# Altium project mwh618.prjpcb (part 2 of 2)

## Sheet soc-io.schdoc: IO
size A4; Date: 09.27.2026; CheckedBy: BCY; DrawnBy: miaow; Revision: v1.0.0; SheetNumber: 7; SheetTotal: 18; BoardType: MAIN_PCB; Desc: Connectivity
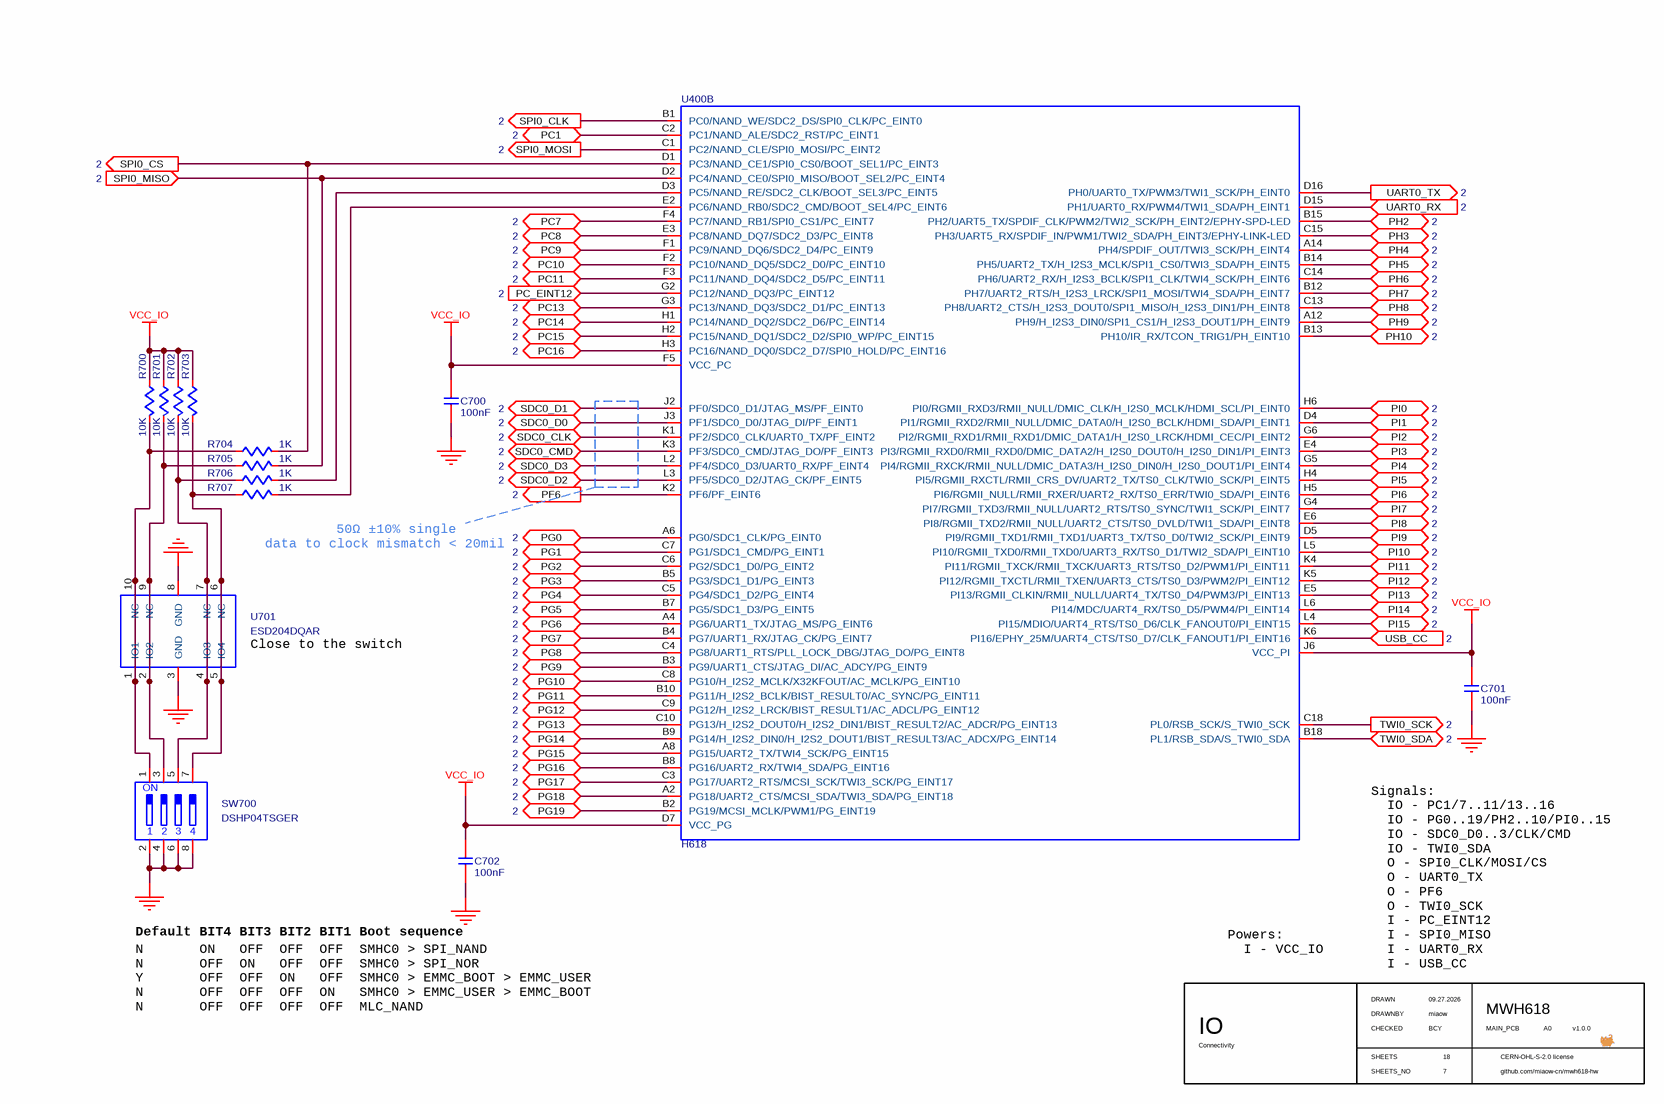
[diagram p8: soc-io.schdoc]

### Parts
C700  value 100nF  [C0201]  (hidden comment: C-NOMO)
C701  value 100nF  [C0201]  (hidden comment: C-NOMO)
C702  value 100nF  [C0201]  (hidden comment: C-NOMO)
R700  value 10K  [R0402]  (hidden comment: R)
R701  value 10K  [R0402]  (hidden comment: R)
R702  value 10K  [R0402]  (hidden comment: R)
R703  value 10K  [R0402]  (hidden comment: R)
R704  value 1K  [R0402]  (hidden comment: R)
R705  value 1K  [R0402]  (hidden comment: R)
R706  value 1K  [R0402]  (hidden comment: R)
R707  value 1K  [R0402]  (hidden comment: R)
SW700  DSHP04TSGER  [DSHP04TSGER]
U400  H618  [H618]  (part B of 4)
U701  ESD204DQAR  [ESD204DQAR]

### Ports
PC1 (bidir, see 2), PC7 (bidir, see 2), PC8 (bidir, see 2), PC9 (bidir, see 2), PC10 (bidir, see 2), PC11 (bidir, see 2), PC13 (bidir, see 2), PC14 (bidir, see 2), PC15 (bidir, see 2), PC16 (bidir, see 2), PC_EINT12 (in, see 2), PF6 (out, see 2), PG0 (bidir, see 2), PG1 (bidir, see 2), PG2 (bidir, see 2), PG3 (bidir, see 2), PG4 (bidir, see 2), PG5 (bidir, see 2), PG6 (bidir, see 2), PG7 (bidir, see 2), PG8 (bidir, see 2), PG9 (bidir, see 2), PG10 (bidir, see 2), PG11 (bidir, see 2), PG12 (bidir, see 2), PG13 (bidir, see 2), PG14 (bidir, see 2), PG15 (bidir, see 2), PG16 (bidir, see 2), PG17 (bidir, see 2), PG18 (bidir, see 2), PG19 (bidir, see 2), PH2 (bidir, see 2), PH3 (bidir, see 2), PH4 (bidir, see 2), PH5 (bidir, see 2), PH6 (bidir, see 2), PH7 (bidir, see 2), PH8 (bidir, see 2), PH9 (bidir, see 2), PH10 (bidir, see 2), PI0 (bidir, see 2), PI1 (bidir, see 2), PI2 (bidir, see 2), PI3 (bidir, see 2), PI4 (bidir, see 2), PI5 (bidir, see 2), PI6 (bidir, see 2), PI7 (bidir, see 2), PI8 (bidir, see 2), PI9 (bidir, see 2), PI10 (bidir, see 2), PI11 (bidir, see 2), PI12 (bidir, see 2), PI13 (bidir, see 2), PI14 (bidir, see 2), PI15 (bidir, see 2), SDC0_CLK (bidir, see 2), SDC0_CMD (bidir, see 2), SDC0_D0 (bidir, see 2), SDC0_D1 (bidir, see 2), SDC0_D2 (bidir, see 2), SDC0_D3 (bidir, see 2), SPI0_CLK (out, see 2), SPI0_CS (out, see 2), SPI0_MISO (in, see 2), SPI0_MOSI (out, see 2), TWI0_SCK (out, see 2), TWI0_SDA (bidir, see 2), UART0_RX (in, see 2), UART0_TX (out, see 2), USB_CC (in, see 2)

### Nets
GND: C700.2 C701.2 C702.2 SW700.2 SW700.4 SW700.6 SW700.8 U701.3(GND) U701.8(GND)
VCC_IO: C700.1 C701.1 C702.1 R700.2 R701.2 R702.2 R703.2 U400.D7(VCC_PG) U400.F5(VCC_PC) U400.J6(VCC_PI)  [project net VCC3V3_DLDO]
_H_3: U400.B8(PG16/UART2_RX/TWI4_SDA/PG_EINT16) ; port PG16
_H_5: U400.A8(PG15/UART2_TX/TWI4_SCK/PG_EINT15) ; port PG15
_H_7: U400.A2(PG18/UART2_CTS/MCSI_SDA/TWI3_SDA/PG_EINT18) ; port PG18
_H_11: U400.C3(PG17/UART2_RTS/MCSI_SCK/TWI3_SCK/PG_EINT17) ; port PG17
_H_12: U400.B2(PG19/MCSI_MCLK/PWM1/PG_EINT19) ; port PG19
_H_13: U400.E3(PC8/NAND_DQ7/SDC2_D3/PC_EINT8) ; port PC8
_H_15: U400.B13(PH10/IR_RX/TCON_TRIG1/PH_EINT10) ; port PH10
_H_16: U400.H3(PC16/NAND_DQ0/SDC2_D7/SPI0_HOLD/PC_EINT16) ; port PC16
_H_18: U400.G3(PC13/NAND_DQ3/SDC2_D1/PC_EINT13) ; port PC13
_H_19: U400.B12(PH7/UART2_RTS/H_I2S3_LRCK/SPI1_MOSI/TWI4_SDA/PH_EINT7) ; port PH7
_H_21: U400.C13(PH8/UART2_CTS/H_I2S3_DOUT0/SPI1_MISO/H_I2S3_DIN1/PH_EINT8) ; port PH8
_H_22: U400.H2(PC15/NAND_DQ1/SDC2_D2/SPI0_WP/PC_EINT15) ; port PC15
_H_23: U400.C14(PH6/UART2_RX/H_I2S3_BCLK/SPI1_CLK/TWI4_SCK/PH_EINT6) ; port PH6
_H_24: U400.H1(PC14/NAND_DQ2/SDC2_D6/PC_EINT14) ; port PC14
_H_26: U400.F2(PC10/NAND_DQ5/SDC2_D0/PC_EINT10) ; port PC10
_H_27: U400.F3(PC11/NAND_DQ4/SDC2_D5/PC_EINT11) ; port PC11
_H_28: U400.F1(PC9/NAND_DQ6/SDC2_D4/PC_EINT9) ; port PC9
_H_29: U400.F4(PC7/NAND_RB1/SPI0_CS1/PC_EINT7) ; port PC7
_H_31: U400.C9(PG12/H_I2S2_LRCK/BIST_RESULT1/AC_ADCL/PG_EINT12) ; port PG12
_H_32: U400.C2(PC1/NAND_ALE/SDC2_RST/PC_EINT1) ; port PC1
_H_33: U400.B10(PG11/H_I2S2_BCLK/BIST_RESULT0/AC_SYNC/PG_EINT11) ; port PG11
_H_35: U400.A12(PH9/H_I2S3_DIN0/SPI1_CS1/H_I2S3_DOUT1/PH_EINT9) ; port PH9
_H_36: U400.B9(PG14/H_I2S2_DIN0/H_I2S2_DOUT1/BIST_RESULT3/AC_ADCX/PG_EINT14) ; port PG14
_H_37: U400.B14(PH5/UART2_TX/H_I2S3_MCLK/SPI1_CS0/TWI3_SDA/PH_EINT5) ; port PH5
_H_38: U400.C10(PG13/H_I2S2_DOUT0/H_I2S2_DIN1/BIST_RESULT2/AC_ADCR/PG_EINT13) ; port PG13
_H_40: U400.A14(PH4/SPDIF_OUT/TWI3_SCK/PH_EINT4) ; port PH4
DEBUG_RX: U400.D16(PH0/UART0_TX/PWM3/TWI1_SCK/PH_EINT0) ; port UART0_TX
DEBUG_TX: U400.D15(PH1/UART0_RX/PWM4/TWI1_SDA/PH_EINT1) ; port UART0_RX
FLASH_CLK: U400.B1(PC0/NAND_WE/SDC2_DS/SPI0_CLK/PC_EINT0) ; port SPI0_CLK
FLASH_CS: R704.1 U400.D1(PC3/NAND_CE1/SPI0_CS0/BOOT_SEL1/PC_EINT3) ; port SPI0_CS
FLASH_MISO: R705.1 U400.D2(PC4/NAND_CE0/SPI0_MISO/BOOT_SEL2/PC_EINT4) ; port SPI0_MISO
FLASH_MOSI: U400.C1(PC2/NAND_CLE/SPI0_MOSI/PC_EINT2) ; port SPI0_MOSI
FPC_1: U400.L4(PI15/MDIO/UART4_RTS/TS0_D6/CLK_FANOUT0/PI_EINT15) ; port PI15
FPC_2: U400.L6(PI14/MDC/UART4_RX/TS0_D5/PWM4/PI_EINT14) ; port PI14
FPC_3: U400.E5(PI13/RGMII_CLKIN/RMII_NULL/UART4_TX/TS0_D4/PWM3/PI_EINT13) ; port PI13
FPC_4: U400.K5(PI12/RGMII_TXCTL/RMII_TXEN/UART3_CTS/TS0_D3/PWM2/PI_EINT12) ; port PI12
FPC_5: U400.K4(PI11/RGMII_TXCK/RMII_TXCK/UART3_RTS/TS0_D2/PWM1/PI_EINT11) ; port PI11
FPC_6: U400.L5(PI10/RGMII_TXD0/RMII_TXD0/UART3_RX/TS0_D1/TWI2_SDA/PI_EINT10) ; port PI10
FPC_7: U400.D5(PI9/RGMII_TXD1/RMII_TXD1/UART3_TX/TS0_D0/TWI2_SCK/PI_EINT9) ; port PI9
FPC_8: U400.E6(PI8/RGMII_TXD2/RMII_NULL/UART2_CTS/TS0_DVLD/TWI1_SDA/PI_EINT8) ; port PI8
FPC_9: U400.G4(PI7/RGMII_TXD3/RMII_NULL/UART2_RTS/TS0_SYNC/TWI1_SCK/PI_EINT7) ; port PI7
FPC_10: U400.H5(PI6/RGMII_NULL/RMII_RXER/UART2_RX/TS0_ERR/TWI0_SDA/PI_EINT6) ; port PI6
FPC_11: U400.H4(PI5/RGMII_RXCTL/RMII_CRS_DV/UART2_TX/TS0_CLK/TWI0_SCK/PI_EINT5) ; port PI5
FPC_12: U400.G5(PI4/RGMII_RXCK/RMII_NULL/DMIC_DATA3/H_I2S0_DIN0/H_I2S0_DOUT1/PI_EINT4) ; port PI4
FPC_13: U400.E4(PI3/RGMII_RXD0/RMII_RXD0/DMIC_DATA2/H_I2S0_DOUT0/H_I2S0_DIN1/PI_EINT3) ; port PI3
FPC_14: U400.G6(PI2/RGMII_RXD1/RMII_RXD1/DMIC_DATA1/H_I2S0_LRCK/HDMI_CEC/PI_EINT2) ; port PI2
FPC_15: U400.D4(PI1/RGMII_RXD2/RMII_NULL/DMIC_DATA0/H_I2S0_BCLK/HDMI_SDA/PI_EINT1) ; port PI1
FPC_16: U400.H6(PI0/RGMII_RXD3/RMII_NULL/DMIC_CLK/H_I2S0_MCLK/HDMI_SCL/PI_EINT0) ; port PI0
FPC_18: U400.C8(PG10/H_I2S2_MCLK/X32KFOUT/AC_MCLK/PG_EINT10) ; port PG10
FPC_19: U400.B3(PG9/UART1_CTS/JTAG_DI/AC_ADCY/PG_EINT9) ; port PG9
FPC_20: U400.C4(PG8/UART1_RTS/PLL_LOCK_DBG/JTAG_DO/PG_EINT8) ; port PG8
FPC_21: U400.B4(PG7/UART1_RX/JTAG_CK/PG_EINT7) ; port PG7
FPC_22: U400.A4(PG6/UART1_TX/JTAG_MS/PG_EINT6) ; port PG6
FPC_23: U400.B7(PG5/SDC1_D3/PG_EINT5) ; port PG5
FPC_24: U400.C5(PG4/SDC1_D2/PG_EINT4) ; port PG4
FPC_25: U400.B5(PG3/SDC1_D1/PG_EINT3) ; port PG3
FPC_26: U400.C6(PG2/SDC1_D0/PG_EINT2) ; port PG2
FPC_27: U400.C7(PG1/SDC1_CMD/PG_EINT1) ; port PG1
FPC_28: U400.A6(PG0/SDC1_CLK/PG_EINT0) ; port PG0
INDICATOR_LED: U400.K2(PF6/PF_EINT6) ; port PF6
PC_EINT12: U400.G2(PC12/NAND_DQ3/PC_EINT12) ; port PC_EINT12
PH2: U400.B15(PH2/UART5_TX/SPDIF_CLK/PWM2/TWI2_SCK/PH_EINT2/EPHY-SPD-LED) ; port PH2
PH3: U400.C15(PH3/UART5_RX/SPDIF_IN/PWM1/TWI2_SDA/PH_EINT3/EPHY-LINK-LED) ; port PH3
PMIC_SCL: U400.C18(PL0/RSB_SCK/S_TWI0_SCK) ; port TWI0_SCK
PMIC_SDA: U400.B18(PL1/RSB_SDA/S_TWI0_SDA) ; port TWI0_SDA
SD_CLK: U400.K1(PF2/SDC0_CLK/UART0_TX/PF_EINT2) ; port SDC0_CLK
SD_CMD: U400.K3(PF3/SDC0_CMD/JTAG_DO/PF_EINT3) ; port SDC0_CMD
SD_D0: U400.J3(PF1/SDC0_D0/JTAG_DI/PF_EINT1) ; port SDC0_D0
SD_D1: U400.J2(PF0/SDC0_D1/JTAG_MS/PF_EINT0) ; port SDC0_D1
SD_D2: U400.L3(PF5/SDC0_D2/JTAG_CK/PF_EINT5) ; port SDC0_D2
SD_D3: U400.L2(PF4/SDC0_D3/UART0_RX/PF_EINT4) ; port SDC0_D3
USB_0_CC: U400.K6(PI16/EPHY_25M/UART4_CTS/TS0_D7/CLK_FANOUT1/PI_EINT16) ; port USB_CC
NetR700_1: R700.1 R704.2 SW700.1 U701.1(IO1) U701.10(NC)
NetR701_1: R701.1 R705.2 SW700.3 U701.2(IO2) U701.9(NC)
NetR702_1: R702.1 R706.2 SW700.5 U701.4(IO3) U701.7(NC)
NetR703_1: R703.1 R707.2 SW700.7 U701.5(IO4) U701.6(NC)
NetR706_1: R706.1 U400.D3(PC5/NAND_RE/SDC2_CLK/BOOT_SEL3/PC_EINT5)
NetR707_1: R707.1 U400.E2(PC6/NAND_RB0/SDC2_CMD/BOOT_SEL4/PC_EINT6)

### Notes on the sheet
- data to clock mismatch < 20mil
- 50Ω ±10% single
- (near U701) Close to the switch
- Default BIT4 BIT3 BIT2 BIT1 Boot sequence
- Powers:
  I - VCC_IO
- Signals:
  IO - PC1/7..11/13..16
  IO - PG0..19/PH2..10/PI0..15
  IO - SDC0_D0..3/CLK/CMD
  IO - TWI0_SDA
  O - SPI0_CLK/MOSI/CS
  O - UART0_TX
  O - PF6
  O - TWI0_SCK
  I - PC_EINT12
  I - SPI0_MISO
  I - UART0_RX
  I - USB_CC
- N       ON   OFF  OFF  OFF  SMHC0 > SPI_NAND
  N       OFF  ON   OFF  OFF  SMHC0 > SPI_NOR
  Y       OFF  OFF  ON   OFF  SMHC0 > EMMC_BOOT > EMMC_USER
  N       OFF  OFF  OFF  ON   SMHC0 > EMMC_USER > EMMC_BOOT
  N       OFF  OFF  OFF  OFF  MLC_NAND
- DRAWN
- CHECKED
- DRAWNBY
- SHEETS
- SHEETS_NO
- (in symbol DSHP04TSGER) ON

### Library data of the parts
C700-C702 = C-NOMO: voltage: 10V; precision: 10%; Supplier 1: LCSC; Supplier Part Number 1: C49062
R700-R707 = R: precision: 1%; Supplier 1: LCSC
  R700-R703: Supplier Part Number 1: C25744
  R704-R707: Supplier Part Number 1: C11702
U400 = H618: SOC; Supplier 1: LCSC; Supplier Part Number 1: C19189292
U701 = ESD204DQAR: TVS/ESD - 4 ch, 3.6V, 5V, 0.55pF@1MHz, 30KV; Supplier 1: LCSC; Supplier Part Number 1: C553132
SW700 = DSHP04TSGER: Supplier 1: LCSC; Supplier Part Number 1: C3293144

## Sheet debug.schdoc: DEBUG
size A4; Date: 10.01.2026; CheckedBy: BCY; DrawnBy: miaow; Revision: v1.0.0; SheetNumber: 14; SheetTotal: 18; BoardType: MAIN_PCB; Desc: UART & console
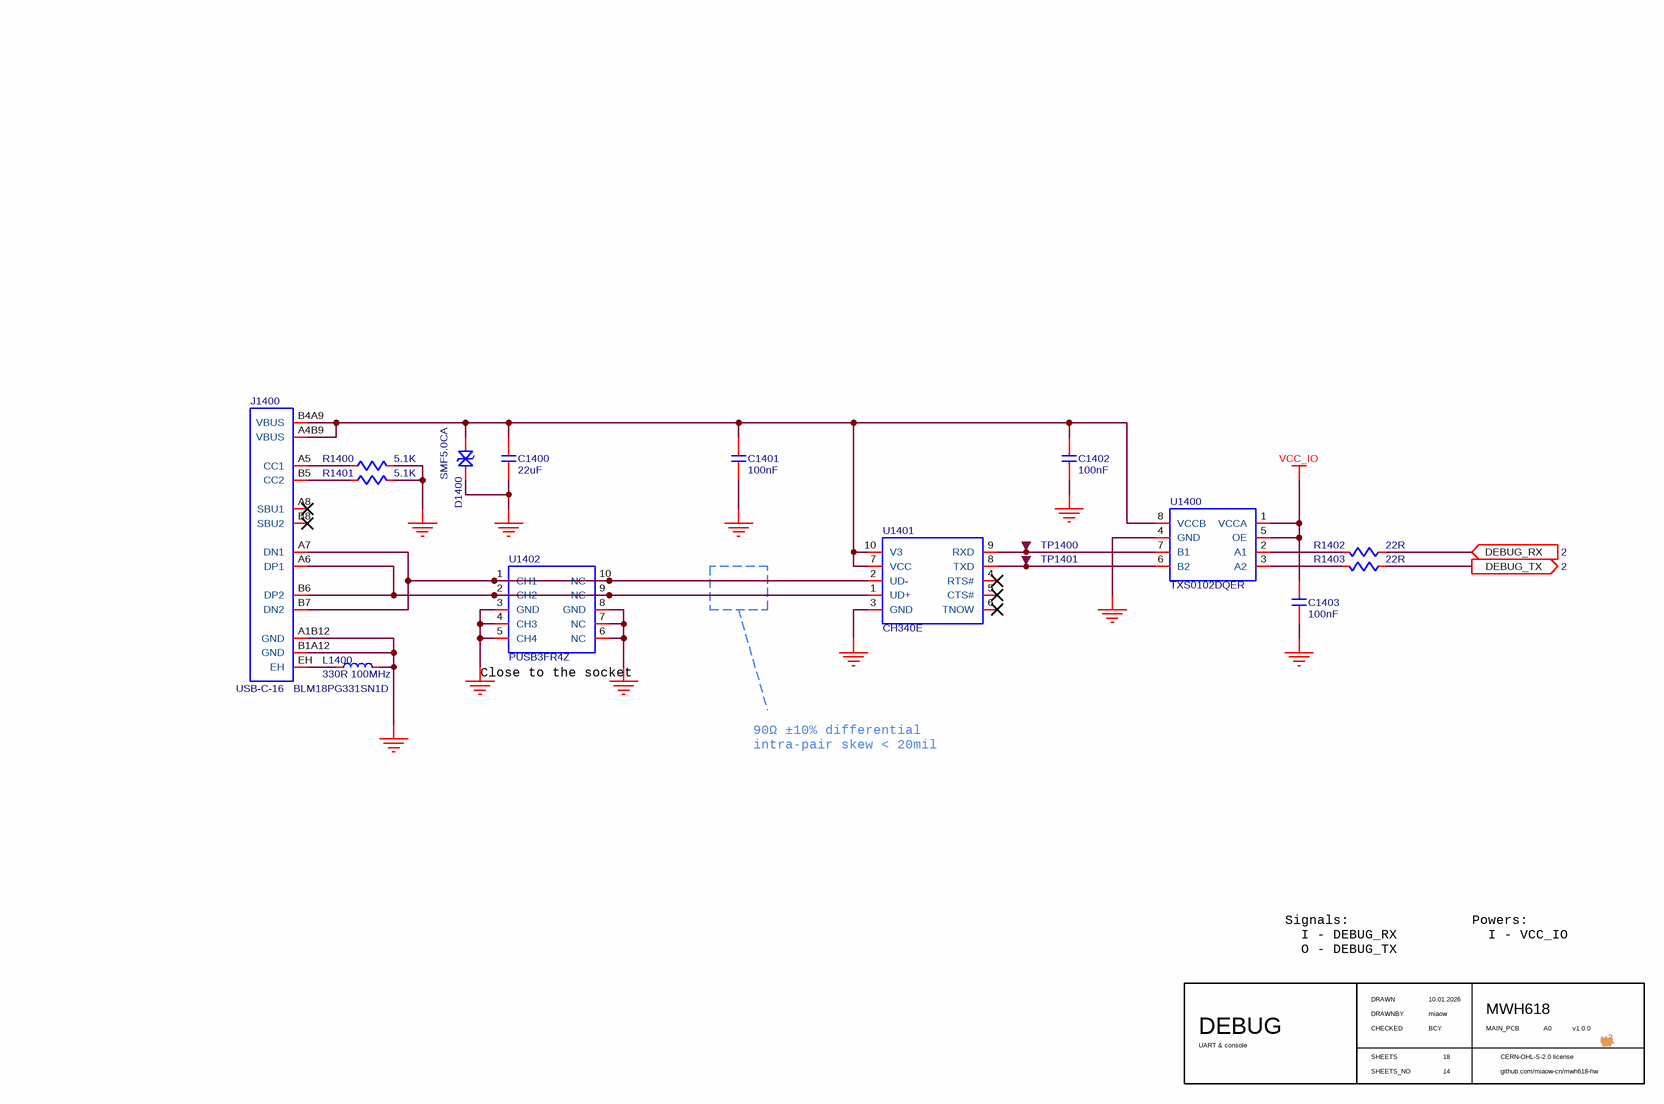
[diagram p9: debug.schdoc]

### Parts
C1400  value 22uF  [C0603]  (hidden comment: C-NOMO)
C1401  value 100nF  [C0402]  (hidden comment: C-NOMO)
C1402  value 100nF  [C0402]  (hidden comment: C-NOMO)
C1403  value 100nF  [C0402]  (hidden comment: C-NOMO)
D1400  SMF5.0CA  [SMF5.0CA]
J1400  USB-C-16  [USB-C-16]
L1400  BLM18PG331SN1D  value 330R 100MHz  [L0603]
R1400  value 5.1K  [R0402]  (hidden comment: R)
R1401  value 5.1K  [R0402]  (hidden comment: R)
R1402  value 22R  [R0402]  (hidden comment: R)
R1403  value 22R  [R0402]  (hidden comment: R)
TP1400  TP  [TP]  (value not drawn)
TP1401  TP  [TP]  (value not drawn)
U1400  TXS0102DQER  [TXS0102DQER]
U1401  CH340E  [CH340E]
U1402  PUSB3FR4Z  [PUSB3FR4Z]

### Ports
DEBUG_RX (in, see 2), DEBUG_TX (out, see 2)

### Nets
GND: C1400.1 C1401.1 C1402.1 C1403.1 D1400.1 J1400.A1B12(GND) J1400.B1A12(GND) L1400.2 R1400.1 R1401.1 U1400.4(GND) U1401.3(GND) U1402.3(GND) U1402.4(CH3) U1402.5(CH4) U1402.6(NC) U1402.7(NC) U1402.8(GND)
VCC_IO: C1403.2 U1400.1(VCCA) U1400.5(OE)  [project net VCC3V3_DLDO]
DEBUG_RX: R1402.2 ; port DEBUG_RX
DEBUG_TX: R1403.2 ; port DEBUG_TX
NetC1400_2: C1400.2 C1401.2 C1402.2 D1400.2 J1400.A4B9(VBUS) J1400.B4A9(VBUS) U1400.8(VCCB) U1401.7(VCC) U1401.10(V3)
NetJ1400_A5: J1400.A5(CC1) R1400.2
NetJ1400_A6: J1400.A6(DP1) J1400.B6(DP2) U1401.1(UD+) U1402.2(CH2) U1402.9(NC)
NetJ1400_A7: J1400.A7(DN1) J1400.B7(DN2) U1401.2(UD-) U1402.1(CH1) U1402.10(NC)
NetJ1400_B5: J1400.B5(CC2) R1401.2
NetJ1400_EH: J1400.EH L1400.1
NetR1402_1: R1402.1 U1400.2(A1)
NetR1403_1: R1403.1 U1400.3(A2)
NetTP1400_0: TP1400.0 U1400.7(B1) U1401.9(RXD)
NetTP1401_0: TP1401.0 U1400.6(B2) U1401.8(TXD)

Not connected (* = marked no-connect by the designer): J1400 A8(SBU1)* B8(SBU2)*; U1401 4(RTS#)* 5(CTS#)* 6(TNOW)*

### Notes on the sheet
- (near U1402) Close to the socket
- 90Ω ±10% differential
- intra-pair skew < 20mil
- Signals:
  I - DEBUG_RX
  O - DEBUG_TX
- Powers:
  I - VCC_IO
- DRAWN
- CHECKED
- DRAWNBY
- SHEETS
- SHEETS_NO

### Library data of the parts
C1400 = C-NOMO: voltage: 10V; precision: 20%; Supplier 1: LCSC; Supplier Part Number 1: C2980159
C1401-C1403 = C-NOMO: voltage: 50V; precision: 10%; Supplier 1: LCSC; Supplier Part Number 1: C307331
D1400 = SMF5.0CA: TVS/ESD; Supplier 1: LCSC; Supplier Part Number 1: C19077498
L1400 = L: Code_IEC: 1005; Published: 8-Jun-2000; LatestRevisionDate: 29-May-2009; LatestRevisionNote: IPC-7351 Footprint Added.; PackageReference: 0402-A; Publisher: Altium Limited; PackageDescription: Chip Inductor; Code_JEITA: 0402; Supplier 1: LCSC; Supplier Part Number 1: C79913
R1400-R1403 = R: precision: 1%; Supplier 1: LCSC
  R1400 R1401: Supplier Part Number 1: C25905
  R1402 R1403: Supplier Part Number 1: C25092
U1400 = TXS0102DQER: LEVEL SHIFT - 2bits, autodir, 1.65V - 3.6V, 2.3V - 5.5V, 24Mbps; Supplier Part Number 1: C2652935; Supplier 1: LCSC
U1401 = CH340E: USB UART; Supplier 1: LCSC; Supplier Part Number 1: C99652
U1402 = PUSB3FR4Z: TVS/ESD - USB, HDMI; Supplier 1: LCSC; Supplier Part Number 1: C503418
J1400 = USB-C-16: Supplier 1: LCSC; Supplier Part Number 1: C165948

## Sheet eth.schdoc: ETH
size A4; Date: 10.02.2026; CheckedBy: BCY; DrawnBy: miaow; Revision: v1.0.0; SheetNumber: 12; SheetTotal: 18; BoardType: MAIN_PCB; Desc: 100Mbps ethernet
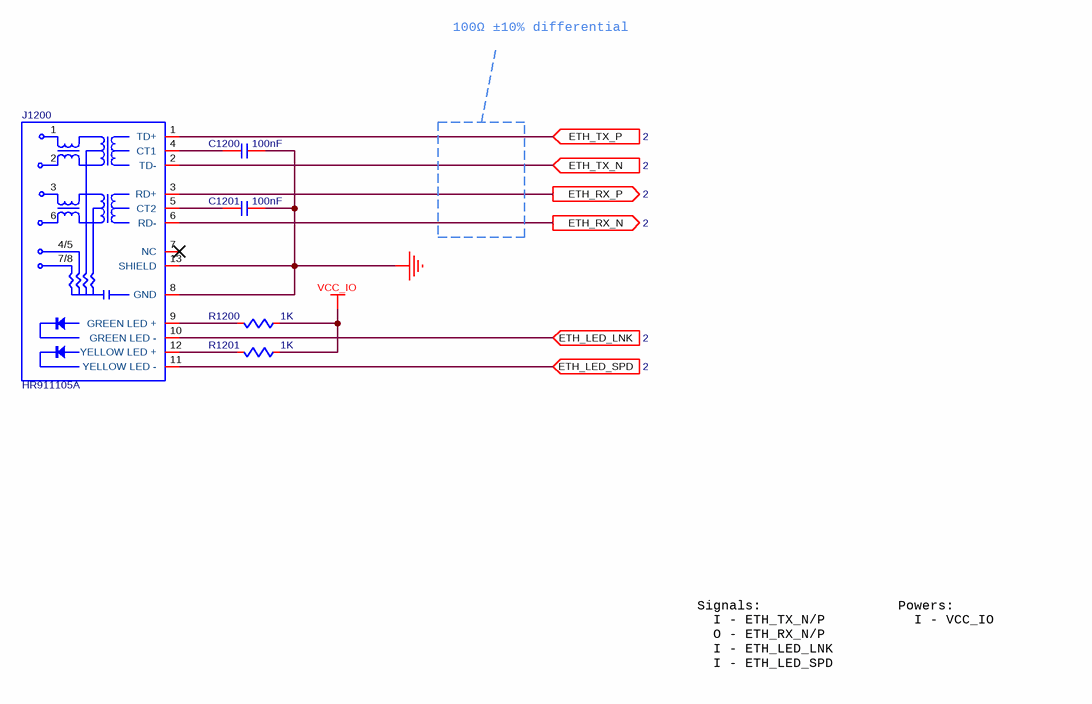
[diagram p10: eth.schdoc]

### Parts
C1200  value 100nF  [C0402]  (hidden comment: C-NOMO)
C1201  value 100nF  [C0402]  (hidden comment: C-NOMO)
J1200  HR911105A  [HR911105A]
R1200  value 1K  [R0402]  (hidden comment: R)
R1201  value 1K  [R0402]  (hidden comment: R)

### Ports
ETH_LED_LNK (in, see 2), ETH_LED_SPD (in, see 2), ETH_RX_N (out, see 2), ETH_RX_P (out, see 2), ETH_TX_N (in, see 2), ETH_TX_P (in, see 2)

### Nets
GND: C1200.1 C1201.1 J1200.8(GND) J1200.13(SHIELD)
VCC_IO: R1200.2 R1201.2  [project net VCC3V3_DLDO]
EPHY_RX_N: J1200.6(RD-) ; port ETH_RX_N
EPHY_RX_P: J1200.3(RD+) ; port ETH_RX_P
EPHY_TX_N: J1200.2(TD-) ; port ETH_TX_N
EPHY_TX_P: J1200.1(TD+) ; port ETH_TX_P
PH2: J1200.11(YELLOW_LED_-) ; port ETH_LED_SPD
PH3: J1200.10(GREEN_LED_-) ; port ETH_LED_LNK
NetC1200_2: C1200.2 J1200.4(CT1)
NetC1201_2: C1201.2 J1200.5(CT2)
NetJ1200_9: J1200.9(GREEN_LED_+) R1200.1
NetJ1200_12: J1200.12(YELLOW_LED_+) R1201.1

Not connected (* = marked no-connect by the designer): J1200 7(NC)*

### Notes on the sheet
- 100Ω ±10% differential
- Signals:
  I - ETH_TX_N/P
  O - ETH_RX_N/P
  I - ETH_LED_LNK
  I - ETH_LED_SPD
- Powers:
  I - VCC_IO
- DRAWN
- CHECKED
- DRAWNBY
- SHEETS
- SHEETS_NO
- (in symbol HR911105A) 4/5; 7/8

### Library data of the parts
C1200 C1201 = C-NOMO: voltage: 50V; precision: 5%; Supplier 1: LCSC; Supplier Part Number 1: C307331
J1200 = HR911105A: RJ45 - 100Mbps, Mag, LED; Supplier 1: LCSC; Supplier Part Number 1: C12074
R1200 R1201 = R: precision: 1%; Supplier 1: LCSC; Supplier Part Number 1: C11702

## Sheet sd.schdoc: SD
size A4; Date: 10.03.2026; CheckedBy: BCY; DrawnBy: miaow; Revision: v1.0.0; SheetNumber: 9; SheetTotal: 18; BoardType: MAIN_PCB; Desc: Micro SD socket
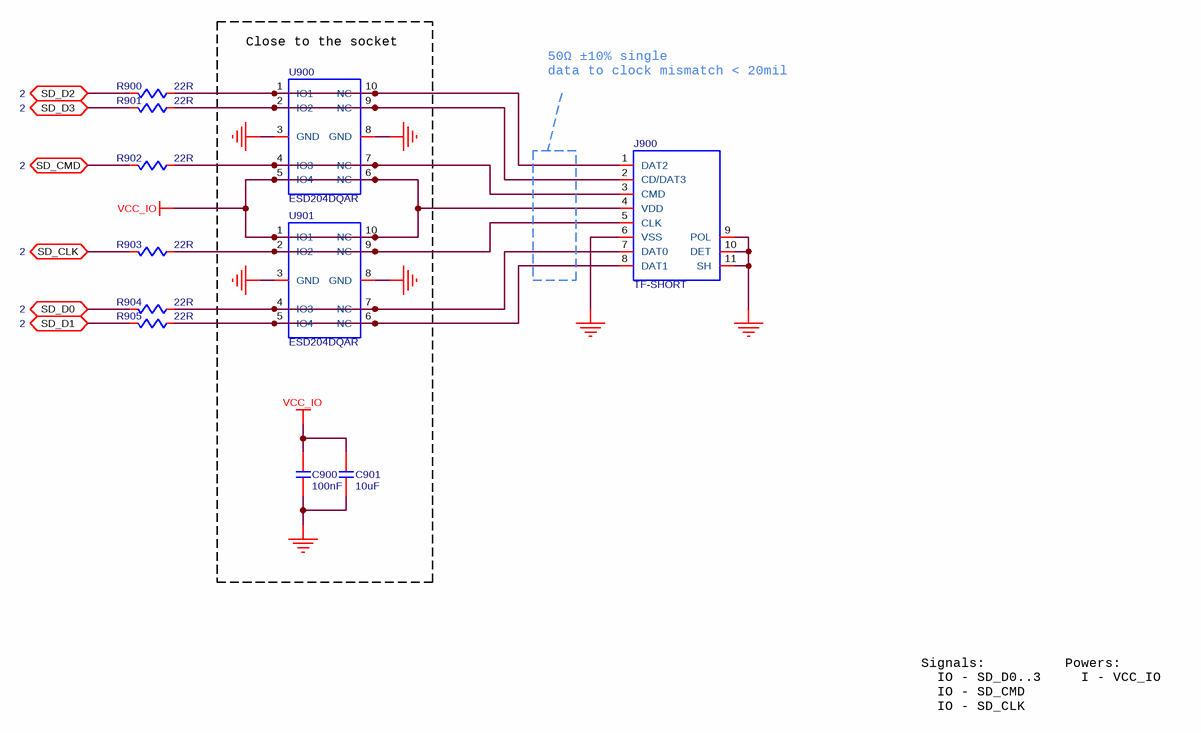
[diagram p11: sd.schdoc]

### Parts
C900  value 100nF  [C0402]  (hidden comment: C-NOMO)
C901  value 10uF  [C0402]  (hidden comment: C-NOMO)
J900  TF-SHORT  [TF-SHORT]
R900  value 22R  [R0402]  (hidden comment: R)
R901  value 22R  [R0402]  (hidden comment: R)
R902  value 22R  [R0402]  (hidden comment: R)
R903  value 22R  [R0402]  (hidden comment: R)
R904  value 22R  [R0402]  (hidden comment: R)
R905  value 22R  [R0402]  (hidden comment: R)
U900  ESD204DQAR  [ESD204DQAR]
U901  ESD204DQAR  [ESD204DQAR]

### Blocks framed on the sheet
Close to the socket: C900 C901 U900 U901

### Ports
SD_CLK (bidir, see 2), SD_CMD (bidir, see 2), SD_D0 (bidir, see 2), SD_D1 (bidir, see 2), SD_D2 (bidir, see 2), SD_D3 (bidir, see 2)

### Nets
GND: C900.2 C901.2 J900.6(VSS) J900.9(POL) J900.10(DET) J900.11(SH) U900.3(GND) U900.8(GND) U901.3(GND) U901.8(GND)
VCC_IO: C900.1 C901.1 J900.4(VDD) U900.5(IO4) U900.6(NC) U901.1(IO1) U901.10(NC)  [project net VCC3V3_DLDO]
SD_CLK: R903.1 ; port SD_CLK
SD_CMD: R902.1 ; port SD_CMD
SD_D0: R904.1 ; port SD_D0
SD_D1: R905.1 ; port SD_D1
SD_D2: R900.1 ; port SD_D2
SD_D3: R901.1 ; port SD_D3
NetJ900_1: J900.1(DAT2) R900.2 U900.1(IO1) U900.10(NC)
NetJ900_2: J900.2(CD/DAT3) R901.2 U900.2(IO2) U900.9(NC)
NetJ900_3: J900.3(CMD) R902.2 U900.4(IO3) U900.7(NC)
NetJ900_5: J900.5(CLK) R903.2 U901.2(IO2) U901.9(NC)
NetJ900_7: J900.7(DAT0) R904.2 U901.4(IO3) U901.7(NC)
NetJ900_8: J900.8(DAT1) R905.2 U901.5(IO4) U901.6(NC)

### Notes on the sheet
- 50Ω ±10% single
- data to clock mismatch < 20mil
- Signals:
  IO - SD_D0..3
  IO - SD_CMD
  IO - SD_CLK
- Powers:
  I - VCC_IO
- DRAWN
- CHECKED
- DRAWNBY
- SHEETS
- SHEETS_NO

### Library data of the parts
C900 = C-NOMO: voltage: 50V; precision: 10%; Supplier 1: LCSC; Supplier Part Number 1: C307331
C901 = C-NOMO: voltage: 6.3V; precision: 20%; Supplier 1: LCSC; Supplier Part Number 1: C15525
J900 = TF-SHORT: SOCKET - MicroSD socket with detction; Supplier 1: LCSC; Supplier Part Number 1: C50380694
R900-R905 = R: precision: 1%; Supplier 1: LCSC; Supplier Part Number 1: C25092
U900 U901 = ESD204DQAR: TVS/ESD - 4 ch, 3.6V, 5V, 0.55pF@1MHz, 30KV; Supplier 1: LCSC; Supplier Part Number 1: C553132

## Sheet flash.schdoc: FLASH
size A4; Date: 10.03.2026; CheckedBy: BCY; DrawnBy: miaow; Revision: v1.0.0; SheetNumber: 8; SheetTotal: 18; BoardType: MAIN_PCB; Desc: SPI nor-flash
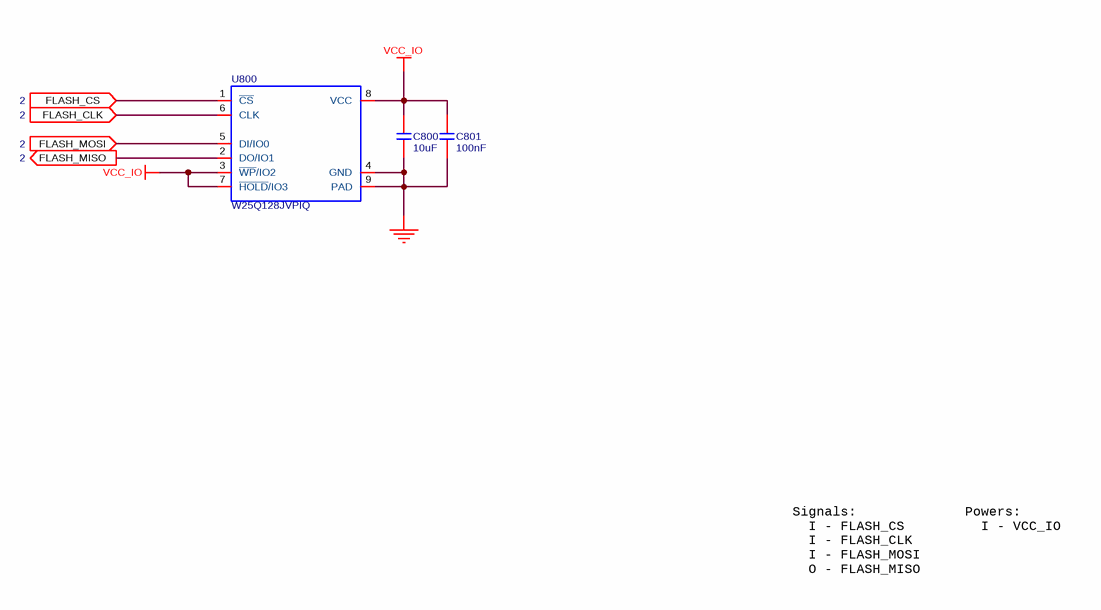
[diagram p12: flash.schdoc]

### Parts
C800  value 10uF  [C0402]  (hidden comment: C-NOMO)
C801  value 100nF  [C0402]  (hidden comment: C-NOMO)
U800  W25Q128JVPIQ  [W25Q128JVPIQ]

### Ports
FLASH_CLK (in, see 2), FLASH_CS (in, see 2), FLASH_MISO (out, see 2), FLASH_MOSI (in, see 2)

### Nets
GND: C800.2 C801.2 U800.4(GND) U800.9(PAD)
VCC_IO: C800.1 C801.1 U800.3(~{WP}/IO2) U800.7(~{HOLD}/IO3) U800.8(VCC)  [project net VCC3V3_DLDO]
FLASH_CLK: U800.6(CLK) ; port FLASH_CLK
FLASH_CS: U800.1(~{CS}) ; port FLASH_CS
FLASH_MISO: U800.2(DO/IO1) ; port FLASH_MISO
FLASH_MOSI: U800.5(DI/IO0) ; port FLASH_MOSI

### Notes on the sheet
- Signals:
  I - FLASH_CS
  I - FLASH_CLK
  I - FLASH_MOSI
  O - FLASH_MISO
- Powers:
  I - VCC_IO
- DRAWN
- CHECKED
- DRAWNBY
- SHEETS
- SHEETS_NO

### Library data of the parts
C800 = C-NOMO: voltage: 6.3V; precision: 20%; Supplier 1: LCSC; Supplier Part Number 1: C15525
C801 = C-NOMO: voltage: 50V; precision: 10%; Supplier 1: LCSC; Supplier Part Number 1: C307331
U800 = W25Q128JVPIQ: NOR FLASH; Supplier 1: LCSC; Supplier Part Number 1: C190862

## Sheet wireless.schdoc: WIRELESS
size A4; Date: 04.10.2026; CheckedBy: BCY; DrawnBy: miaow; Revision: v1.0.0; SheetNumber: 13; SheetTotal: 18; BoardType: MAIN_PCB; Desc: BT & WiFi
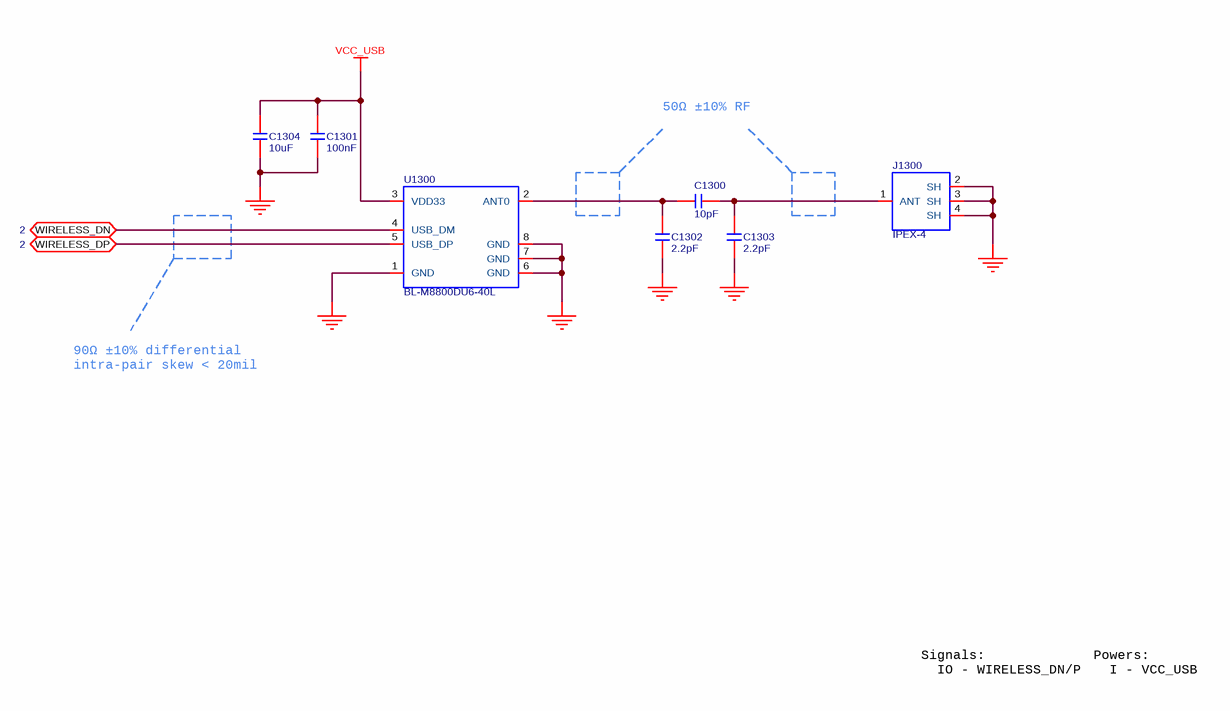
[diagram p13: wireless.schdoc]

### Parts
C1300  value 10pF  [C0201]  (hidden comment: C-NOMO)
C1301  value 100nF  [C0402]  (hidden comment: C-NOMO)
C1302  value 2.2pF  [C0201]  (hidden comment: C-NOMO)
C1303  value 2.2pF  [C0201]  (hidden comment: C-NOMO)
C1304  value 10uF  [C0402]  (hidden comment: C-NOMO)
J1300  IPEX-4  [IPEX-4]
U1300  BL-M8800DU6-40L  [BL-M8800DU6-40L]

### Ports
WIRELESS_DN (bidir, see 2), WIRELESS_DP (bidir, see 2)

### Nets
GND: C1301.2 C1302.2 C1303.2 C1304.1 J1300.2(SH) J1300.3(SH) J1300.4(SH) U1300.1(GND) U1300.6(GND) U1300.7(GND) U1300.8(GND)
VCC_USB: C1301.1 C1304.2 U1300.3(VDD33)  [project net VCC3V3_DLDO]
USB2_D_N: U1300.4(USB_DM) ; port WIRELESS_DN
USB2_D_P: U1300.5(USB_DP) ; port WIRELESS_DP
NetC1300_1: C1300.1 C1303.1 J1300.1(ANT)
NetC1300_2: C1300.2 C1302.1 U1300.2(ANT0)

### Notes on the sheet
- 50Ω ±10% RF
- 90Ω ±10% differential
- intra-pair skew < 20mil
- Signals:
  IO - WIRELESS_DN/P
- Powers:
  I - VCC_USB
- DRAWN
- CHECKED
- DRAWNBY
- SHEETS
- SHEETS_NO

### Library data of the parts
C1300 = C-NOMO: voltage: 25V; precision: 5%; Supplier 1: LCSC; Supplier Part Number 1: C43535
C1301 = C-NOMO: voltage: 50V; precision: 10%; Supplier 1: LCSC; Supplier Part Number 1: C307331
C1302 C1303 = C-NOMO: voltage: 25V; precision: 0.25pF; Supplier 1: LCSC; Supplier Part Number 1: C514586
C1304 = C-NOMO: voltage: 6.3V; precision: 20%; Supplier 1: LCSC; Supplier Part Number 1: C15525
J1300 = IPEX-4: SOCKET - RF; Suppiler 1: LCSC; Supplier Part Number 1: C47986642
U1300 = BL-M8800DU6-40L: BTWIFI; Supplier 1: taobao; Supplier Part Number 1: BL-M8800DU6-40L

## Sheet fpc.schdoc: FPC
size A4; Date: 04.10.2026; CheckedBy: BCY; DrawnBy: miaow; Revision: v1.0.0; SheetNumber: 16; SheetTotal: 18; BoardType: MAIN_PCB; Desc: FPC
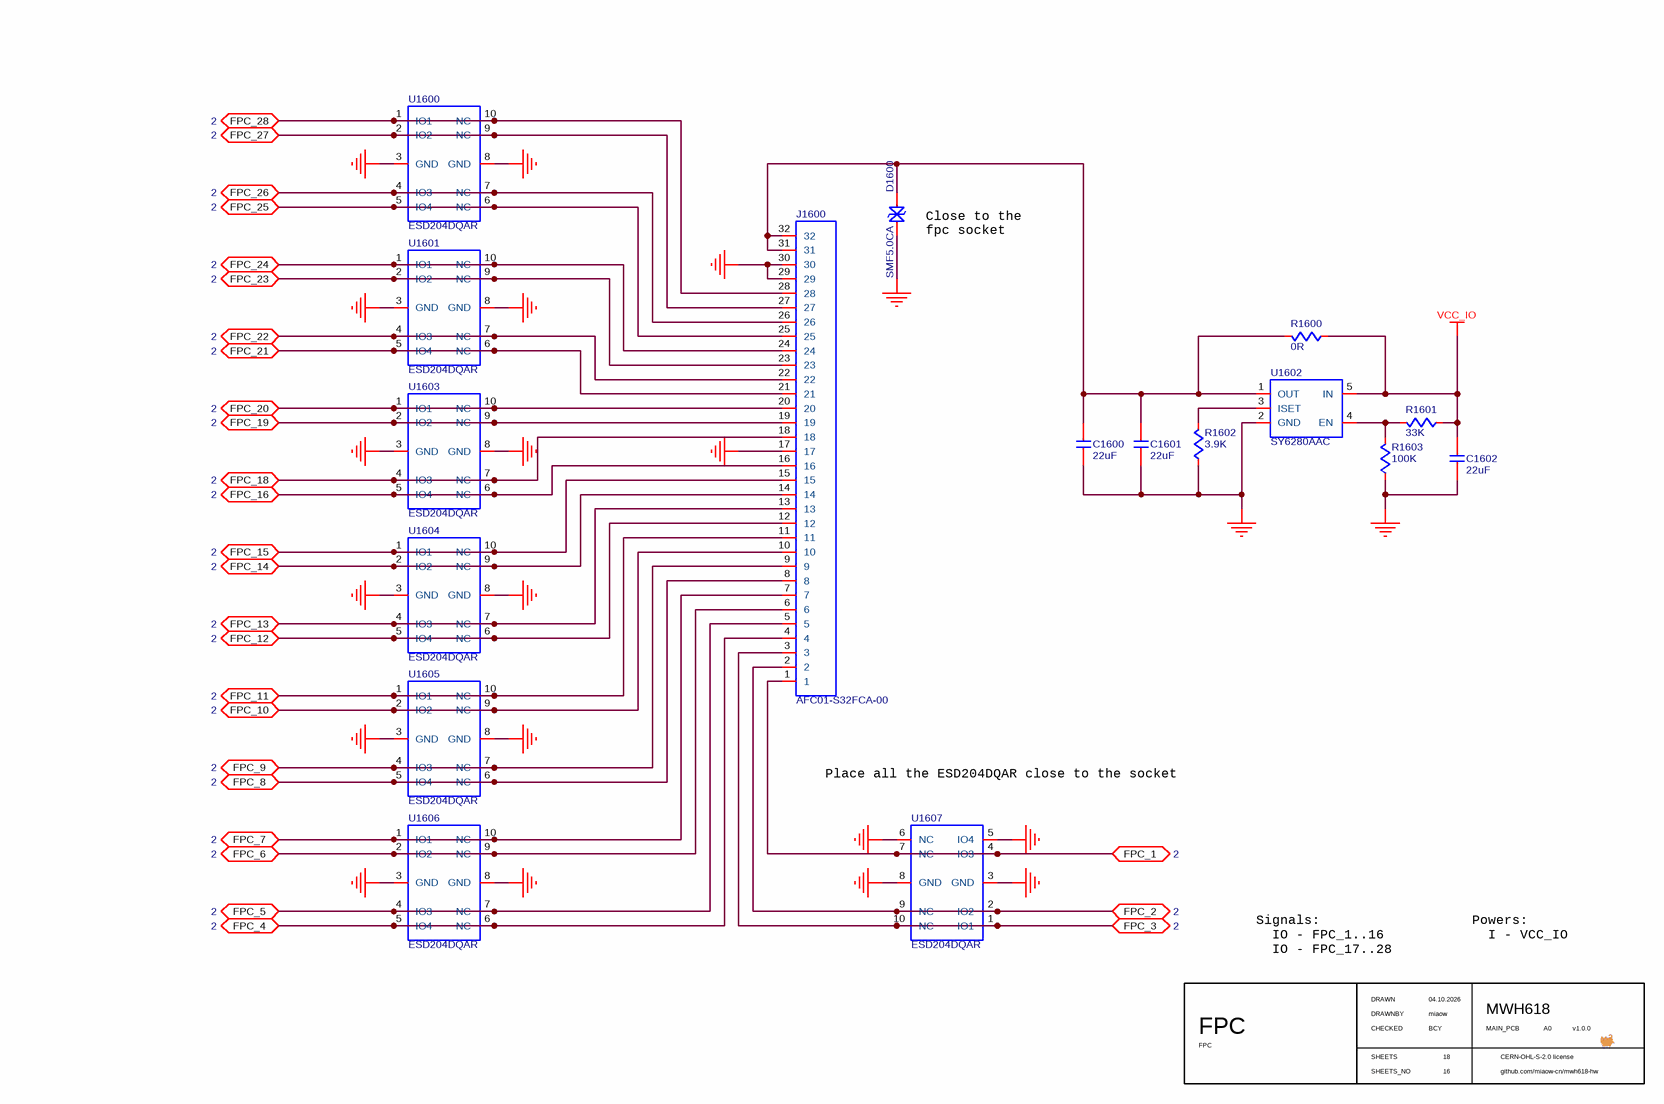
[diagram p14: fpc.schdoc]

### Parts
C1600  value 22uF  [C0603]  (hidden comment: C-NOMO)
C1601  value 22uF  [C0603]  (hidden comment: C-NOMO)
C1602  value 22uF  [C0603]  (hidden comment: C-NOMO)
D1600  SMF5.0CA  [SMF5.0CA]
J1600  AFC01-S32FCA-00  [AFC01-S32FCA-00]
R1600  value 0R  [R1206]  (hidden comment: R)
R1601  value 33K  [R0402]  (hidden comment: R)
R1602  value 3.9K  [R0402]  (hidden comment: R)
R1603  value 100K  [R0402]  (hidden comment: R)
U1600  ESD204DQAR  [ESD204DQAR]
U1601  ESD204DQAR  [ESD204DQAR]
U1602  SY6280AAC  [SY6280AAC]
U1603  ESD204DQAR  [ESD204DQAR]
U1604  ESD204DQAR  [ESD204DQAR]
U1605  ESD204DQAR  [ESD204DQAR]
U1606  ESD204DQAR  [ESD204DQAR]
U1607  ESD204DQAR  [ESD204DQAR]

### Ports
FPC_1 (bidir, see 2), FPC_2 (bidir, see 2), FPC_3 (bidir, see 2), FPC_4 (bidir, see 2), FPC_5 (bidir, see 2), FPC_6 (bidir, see 2), FPC_7 (bidir, see 2), FPC_8 (bidir, see 2), FPC_9 (bidir, see 2), FPC_10 (bidir, see 2), FPC_11 (bidir, see 2), FPC_12 (bidir, see 2), FPC_13 (bidir, see 2), FPC_14 (bidir, see 2), FPC_15 (bidir, see 2), FPC_16 (bidir, see 2), FPC_18 (bidir, see 2), FPC_19 (bidir, see 2), FPC_20 (bidir, see 2), FPC_21 (bidir, see 2), FPC_22 (bidir, see 2), FPC_23 (bidir, see 2), FPC_24 (bidir, see 2), FPC_25 (bidir, see 2), FPC_26 (bidir, see 2), FPC_27 (bidir, see 2), FPC_28 (bidir, see 2)

### Nets
GND: C1600.2 C1601.2 C1602.2 D1600.1 J1600.17 J1600.29 J1600.30 R1602.2 R1603.2 U1600.3(GND) U1600.8(GND) U1601.3(GND) U1601.8(GND) U1602.2(GND) U1603.3(GND) U1603.8(GND) U1604.3(GND) U1604.8(GND) U1605.3(GND) U1605.8(GND) U1606.3(GND) U1606.8(GND) U1607.3(GND) U1607.5(IO4) U1607.6(NC) U1607.8(GND)
VCC_IO: C1602.1 R1600.2 R1601.2 U1602.5(IN)  [project net VCC3V3_DLDO]
FPC_1: J1600.1 U1607.4(IO3) U1607.7(NC) ; port FPC_1
FPC_2: J1600.2 U1607.2(IO2) U1607.9(NC) ; port FPC_2
FPC_3: J1600.3 U1607.1(IO1) U1607.10(NC) ; port FPC_3
FPC_4: J1600.4 U1606.5(IO4) U1606.6(NC) ; port FPC_4
FPC_5: J1600.5 U1606.4(IO3) U1606.7(NC) ; port FPC_5
FPC_6: J1600.6 U1606.2(IO2) U1606.9(NC) ; port FPC_6
FPC_7: J1600.7 U1606.1(IO1) U1606.10(NC) ; port FPC_7
FPC_8: J1600.8 U1605.5(IO4) U1605.6(NC) ; port FPC_8
FPC_9: J1600.9 U1605.4(IO3) U1605.7(NC) ; port FPC_9
FPC_10: J1600.10 U1605.2(IO2) U1605.9(NC) ; port FPC_10
FPC_11: J1600.11 U1605.1(IO1) U1605.10(NC) ; port FPC_11
FPC_12: J1600.12 U1604.5(IO4) U1604.6(NC) ; port FPC_12
FPC_13: J1600.13 U1604.4(IO3) U1604.7(NC) ; port FPC_13
FPC_14: J1600.14 U1604.2(IO2) U1604.9(NC) ; port FPC_14
FPC_15: J1600.15 U1604.1(IO1) U1604.10(NC) ; port FPC_15
FPC_16: J1600.16 U1603.5(IO4) U1603.6(NC) ; port FPC_16
FPC_18: J1600.18 U1603.4(IO3) U1603.7(NC) ; port FPC_18
FPC_19: J1600.19 U1603.2(IO2) U1603.9(NC) ; port FPC_19
FPC_20: J1600.20 U1603.1(IO1) U1603.10(NC) ; port FPC_20
FPC_21: J1600.21 U1601.5(IO4) U1601.6(NC) ; port FPC_21
FPC_22: J1600.22 U1601.4(IO3) U1601.7(NC) ; port FPC_22
FPC_23: J1600.23 U1601.2(IO2) U1601.9(NC) ; port FPC_23
FPC_24: J1600.24 U1601.1(IO1) U1601.10(NC) ; port FPC_24
FPC_25: J1600.25 U1600.5(IO4) U1600.6(NC) ; port FPC_25
FPC_26: J1600.26 U1600.4(IO3) U1600.7(NC) ; port FPC_26
FPC_27: J1600.27 U1600.2(IO2) U1600.9(NC) ; port FPC_27
FPC_28: J1600.28 U1600.1(IO1) U1600.10(NC) ; port FPC_28
NetC1600_1: C1600.1 C1601.1 D1600.2 J1600.31 J1600.32 R1600.1 U1602.1(OUT)
NetR1601_1: R1601.1 R1603.1 U1602.4(EN)
NetR1602_1: R1602.1 U1602.3(ISET)

### Notes on the sheet
- (near D1600) Close to the fpc socket
- Place all the ESD204DQAR close to the socket
- Signals:
  IO - FPC_1..16
  IO - FPC_17..28
- Powers:
  I - VCC_IO
- DRAWN
- CHECKED
- DRAWNBY
- SHEETS
- SHEETS_NO

### Library data of the parts
C1600-C1602 = C-NOMO: voltage: 10V; precision: 20%; Supplier 1: LCSC; Supplier Part Number 1: C2980159
D1600 = SMF5.0CA: TVS/ESD; Supplier 1: LCSC; Supplier Part Number 1: C19077498
J1600 = AFC01-S32FCA-00: FPC - flip, 32p, 0.5mm; Supplier 1: LCSC; Supplier Part Number 1: C262672
R1600 = R: precision: 30mR; Supplier 1: LCSC; Supplier Part Number 1: C2907363
R1601-R1603 = R: precision: 1%; Supplier 1: LCSC
  R1601: Supplier Part Number 1: C25779
  R1602: Supplier Part Number 1: C51721
  R1603: Supplier Part Number 1: C25741
U1600 U1601 U1603-U1607 = ESD204DQAR: as U900 on sheet sd; Supplier 1: LCSC; Supplier Part Number 1: C553132
U1602 = SY6280AAC: PWR SWITCH; Supplier 1: LCSC; Supplier Part Number 1: C55136

## Sheet header.schdoc: HEADER
size A4; Date: 10.05.2026; CheckedBy: BCY; DrawnBy: miaow; Revision: v1.0.0; SheetNumber: 17; SheetTotal: 18; BoardType: MAIN_PCB; Desc: 40-pin header
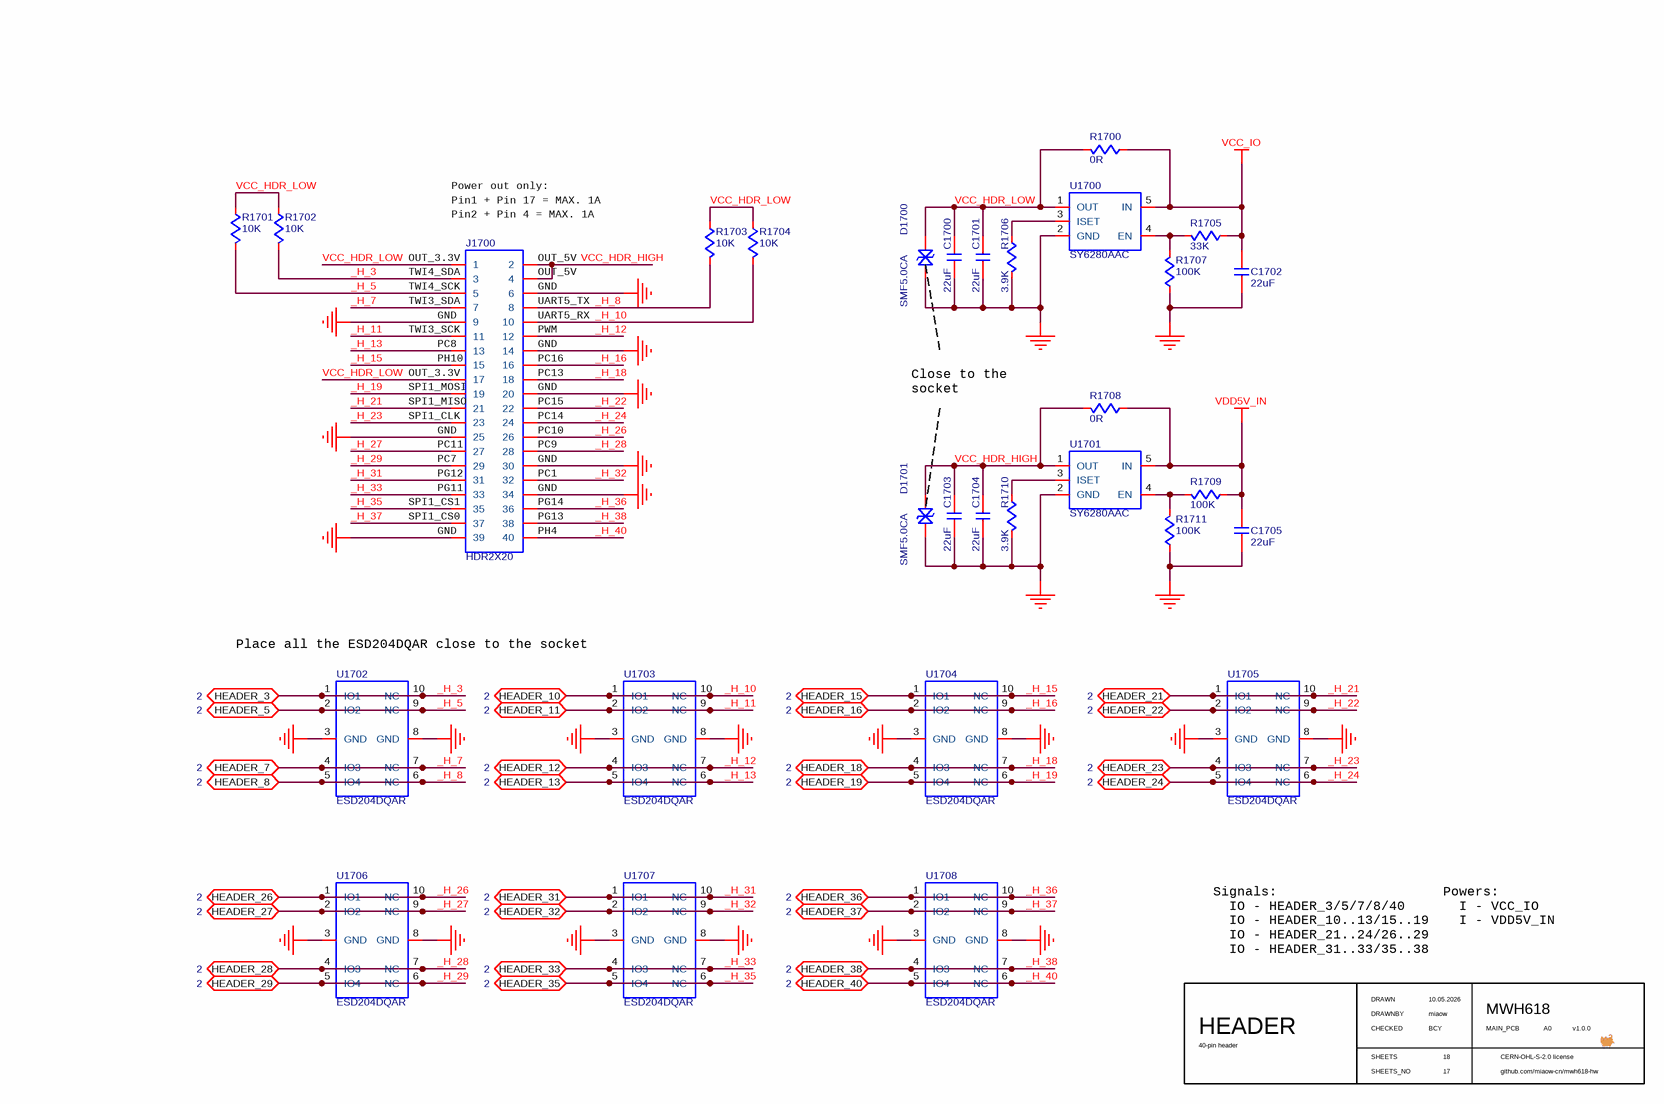
[diagram p15: header.schdoc]

### Parts
C1700  value 22uF  [C0603]  (hidden comment: C-NOMO)
C1701  value 22uF  [C0603]  (hidden comment: C-NOMO)
C1702  value 22uF  [C0603]  (hidden comment: C-NOMO)
C1703  value 22uF  [C0603]  (hidden comment: C-NOMO)
C1704  value 22uF  [C0603]  (hidden comment: C-NOMO)
C1705  value 22uF  [C0603]  (hidden comment: C-NOMO)
D1700  SMF5.0CA  [SMF5.0CA]
D1701  SMF5.0CA  [SMF5.0CA]
J1700  HDR2X20  [HDR2X20]
R1700  value 0R  [R1206]  (hidden comment: R)
R1701  value 10K  [R0402]  (hidden comment: R)
R1702  value 10K  [R0402]  (hidden comment: R)
R1703  value 10K  [R0402]  (hidden comment: R)
R1704  value 10K  [R0402]  (hidden comment: R)
R1705  value 33K  [R0402]  (hidden comment: R)
R1706  value 3.9K  [R0402]  (hidden comment: R)
R1707  value 100K  [R0402]  (hidden comment: R)
R1708  value 0R  [R1206]  (hidden comment: R)
R1709  value 100K  [R0402]  (hidden comment: R)
R1710  value 3.9K  [R0402]  (hidden comment: R)
R1711  value 100K  [R0402]  (hidden comment: R)
U1700  SY6280AAC  [SY6280AAC]
U1701  SY6280AAC  [SY6280AAC]
U1702  ESD204DQAR  [ESD204DQAR]
U1703  ESD204DQAR  [ESD204DQAR]
U1704  ESD204DQAR  [ESD204DQAR]
U1705  ESD204DQAR  [ESD204DQAR]
U1706  ESD204DQAR  [ESD204DQAR]
U1707  ESD204DQAR  [ESD204DQAR]
U1708  ESD204DQAR  [ESD204DQAR]

### Ports
HEADER_3 (bidir, see 2), HEADER_5 (bidir, see 2), HEADER_7 (bidir, see 2), HEADER_8 (bidir, see 2), HEADER_10 (bidir, see 2), HEADER_11 (bidir, see 2), HEADER_12 (bidir, see 2), HEADER_13 (bidir, see 2), HEADER_15 (bidir, see 2), HEADER_16 (bidir, see 2), HEADER_18 (bidir, see 2), HEADER_19 (bidir, see 2), HEADER_21 (bidir, see 2), HEADER_22 (bidir, see 2), HEADER_23 (bidir, see 2), HEADER_24 (bidir, see 2), HEADER_26 (bidir, see 2), HEADER_27 (bidir, see 2), HEADER_28 (bidir, see 2), HEADER_29 (bidir, see 2), HEADER_31 (bidir, see 2), HEADER_32 (bidir, see 2), HEADER_33 (bidir, see 2), HEADER_35 (bidir, see 2), HEADER_36 (bidir, see 2), HEADER_37 (bidir, see 2), HEADER_38 (bidir, see 2), HEADER_40 (bidir, see 2)

### Nets
GND: C1700.1 C1701.1 C1702.2 C1703.1 C1704.1 C1705.1 D1700.1 D1701.1 J1700.6 J1700.9 J1700.14 J1700.20 J1700.25 J1700.30 J1700.34 J1700.39 R1706.1 R1707.2 R1710.1 R1711.2 U1700.2(GND) U1701.2(GND) U1702.3(GND) U1702.8(GND) U1703.3(GND) U1703.8(GND) U1704.3(GND) U1704.8(GND) U1705.3(GND) U1705.8(GND) U1706.3(GND) U1706.8(GND) U1707.3(GND) U1707.8(GND) U1708.3(GND) U1708.8(GND)
VCC_IO: C1702.1 R1700.2 R1705.2 U1700.5(IN)  [project net VCC3V3_DLDO]
VDD5V_IN: C1705.2 R1708.2 R1709.2 U1701.5(IN)
_H_3: J1700.3 R1702.1 U1702.1(IO1) U1702.10(NC) ; port HEADER_3
_H_5: J1700.5 R1701.1 U1702.2(IO2) U1702.9(NC) ; port HEADER_5
_H_7: J1700.7 U1702.4(IO3) U1702.7(NC) ; port HEADER_7
_H_8: J1700.8 R1703.1 U1702.5(IO4) U1702.6(NC) ; port HEADER_8  [project net PH2]
_H_10: J1700.10 R1704.1 U1703.1(IO1) U1703.10(NC) ; port HEADER_10  [project net PH3]
_H_11: J1700.11 U1703.2(IO2) U1703.9(NC) ; port HEADER_11
_H_12: J1700.12 U1703.4(IO3) U1703.7(NC) ; port HEADER_12
_H_13: J1700.13 U1703.5(IO4) U1703.6(NC) ; port HEADER_13
_H_15: J1700.15 U1704.1(IO1) U1704.10(NC) ; port HEADER_15
_H_16: J1700.16 U1704.2(IO2) U1704.9(NC) ; port HEADER_16
_H_18: J1700.18 U1704.4(IO3) U1704.7(NC) ; port HEADER_18
_H_19: J1700.19 U1704.5(IO4) U1704.6(NC) ; port HEADER_19
_H_21: J1700.21 U1705.1(IO1) U1705.10(NC) ; port HEADER_21
_H_22: J1700.22 U1705.2(IO2) U1705.9(NC) ; port HEADER_22
_H_23: J1700.23 U1705.4(IO3) U1705.7(NC) ; port HEADER_23
_H_24: J1700.24 U1705.5(IO4) U1705.6(NC) ; port HEADER_24
_H_26: J1700.26 U1706.1(IO1) U1706.10(NC) ; port HEADER_26
_H_27: J1700.27 U1706.2(IO2) U1706.9(NC) ; port HEADER_27
_H_28: J1700.28 U1706.4(IO3) U1706.7(NC) ; port HEADER_28
_H_29: J1700.29 U1706.5(IO4) U1706.6(NC) ; port HEADER_29
_H_31: J1700.31 U1707.1(IO1) U1707.10(NC) ; port HEADER_31
_H_32: J1700.32 U1707.2(IO2) U1707.9(NC) ; port HEADER_32
_H_33: J1700.33 U1707.4(IO3) U1707.7(NC) ; port HEADER_33
_H_35: J1700.35 U1707.5(IO4) U1707.6(NC) ; port HEADER_35
_H_36: J1700.36 U1708.1(IO1) U1708.10(NC) ; port HEADER_36
_H_37: J1700.37 U1708.2(IO2) U1708.9(NC) ; port HEADER_37
_H_38: J1700.38 U1708.4(IO3) U1708.7(NC) ; port HEADER_38
_H_40: J1700.40 U1708.5(IO4) U1708.6(NC) ; port HEADER_40
VCC_HDR_HIGH: C1703.2 C1704.2 D1701.2 J1700.2 J1700.4 R1708.1 U1701.1(OUT)
VCC_HDR_LOW: C1700.2 C1701.2 D1700.2 J1700.1 J1700.17 R1700.1 R1701.2 R1702.2 R1703.2 R1704.2 U1700.1(OUT)
NetR1705_1: R1705.1 R1707.1 U1700.4(EN)
NetR1706_2: R1706.2 U1700.3(ISET)
NetR1709_1: R1709.1 R1711.1 U1701.4(EN)
NetR1710_2: R1710.2 U1701.3(ISET)

### Notes on the sheet
- Power out only:
- (near J1700) OUT_3.3V
- Pin1 + Pin 17 = MAX. 1A
- (near J1700) Pin2 + Pin 4 = MAX. 1A
- (near J1700) OUT_5V
- (near J1700) TWI4_SDA
- (near J1700) TWI4_SCK
- (near J1700) TWI3_SDA
- (near J1700) TWI3_SCK
- (near J1700) GND
- (near J1700) UART5_TX
- (near J1700) UART5_RX
- (near J1700) PWM
- (near J1700) SPI1_MOSI
- (near J1700) SPI1_MISO
- (near J1700) PC8
- (near J1700) PH10
- (near J1700) PC16
- (near J1700) PC13
- (near J1700) PC15
- Close to the socket
- (near J1700) SPI1_CLK
- (near J1700) PC11
- (near J1700) PC7
- (near J1700) PG12
- (near J1700) PC14
- (near J1700) PC10
- (near J1700) PC9
- (near J1700) PC1
- (near J1700) SPI1_CS1
- (near J1700) SPI1_CS0
- (near J1700) PG11
- (near J1700) PG14
- (near J1700) PG13
- (near J1700) PH4
- (near U1702) Place all the ESD204DQAR close to the socket
- Signals:
  IO - HEADER_3/5/7/8/40
  IO - HEADER_10..13/15..19
  IO - HEADER_21..24/26..29
  IO - HEADER_31..33/35..38
- Powers:
  I - VCC_IO
  I - VDD5V_IN
- DRAWN
- CHECKED
- DRAWNBY
- SHEETS
- SHEETS_NO

### Library data of the parts
C1700-C1705 = C-NOMO: voltage: 10V; precision: 20%; Supplier 1: LCSC; Supplier Part Number 1: C2980159
D1700 D1701 = SMF5.0CA: TVS/ESD; Supplier 1: LCSC; Supplier Part Number 1: C19077498
R1700 R1708 = R: precision: 30mR; Supplier 1: LCSC; Supplier Part Number 1: C2907363
R1701-R1707 R1709-R1711 = R: precision: 1%; Supplier 1: LCSC
  R1701-R1704: Supplier Part Number 1: C25744
  R1705: Supplier Part Number 1: C25779
  R1706 R1710: Supplier Part Number 1: C51721
  R1707 R1709 R1711: Supplier Part Number 1: C25741
U1700 U1701 = SY6280AAC: PWR SWITCH; Supplier 1: LCSC; Supplier Part Number 1: C55136
U1702-U1708 = ESD204DQAR: as U900 on sheet sd; Supplier 1: LCSC; Supplier Part Number 1: C553132
J1700 = HDR2X20: Supplier 1: LCSC; Supplier Part Number 1: C124383

## Sheet indicator.schdoc: INDICATOR
size A4; Date: 10.03.2026; CheckedBy: BCY; DrawnBy: miaow; Revision: v1.0.0; SheetNumber: 15; SheetTotal: 17; BoardType: MAIN_PCB; Desc: LEDs
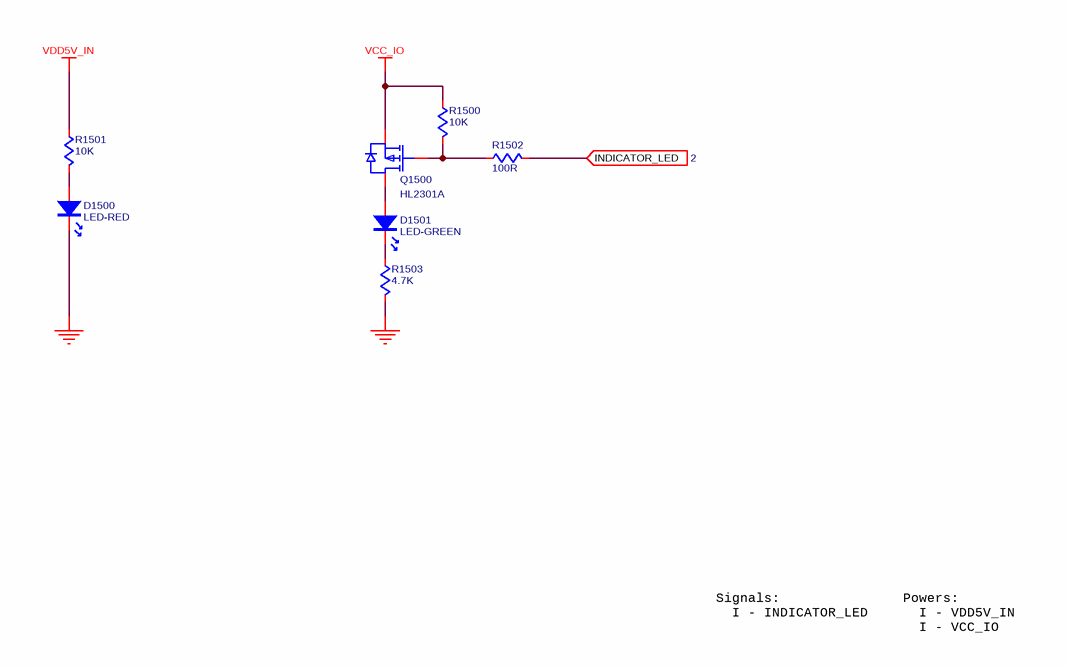
[diagram p16: indicator.schdoc]

### Parts
D1500  LED-RED  [LED0603]
D1501  LED-GREEN  [LED0603]
Q1500  HL2301A  [HL2301A]
R1500  value 10K  [R0402]  (hidden comment: R)
R1501  value 10K  [R0402]  (hidden comment: R)
R1502  value 100R  [R0402]  (hidden comment: R)
R1503  value 4.7K  [R0402]  (hidden comment: R)

### Ports
INDICATOR_LED (in, see 2)

### Nets
GND: D1500.1 R1503.1
VCC_IO: Q1500.S R1500.2  [project net VCC3V3_DLDO]
VDD5V_IN: R1501.2
INDICATOR_LED: R1502.1 ; port INDICATOR_LED
NetD1500_2: D1500.2 R1501.1
NetD1501_1: D1501.1 R1503.2
NetD1501_2: D1501.2 Q1500.D
NetQ1500_G: Q1500.G R1500.1 R1502.2

### Notes on the sheet
- Signals:
  I - INDICATOR_LED
- Powers:
  I - VDD5V_IN
  I - VCC_IO
- DRAWN
- CHECKED
- DRAWNBY
- SHEETS
- SHEETS_NO

### Library data of the parts
D1500 D1501 = LED: Supplier 1: LCSC
  D1500: Supplier Part Number 1: C84263
  D1501: Supplier Part Number 1: C19189745
Q1500 = HL2301A: PMOS; Supplier 1: LCSC; Supplier Part Number 1: C7420344
R1500-R1503 = R: precision: 1%; Supplier 1: LCSC
  R1500 R1501: Supplier Part Number 1: C25744
  R1502: Supplier Part Number 1: C25076
  R1503: Supplier Part Number 1: C25900

## Sheet misc.schdoc: MISC
size A4; Date: 10.06.2025; CheckedBy: BCY; DrawnBy: miaow; Revision: v1.0.0; SheetNumber: 18; SheetTotal: 18; BoardType: MAIN_PCB; Desc: Mechanical items
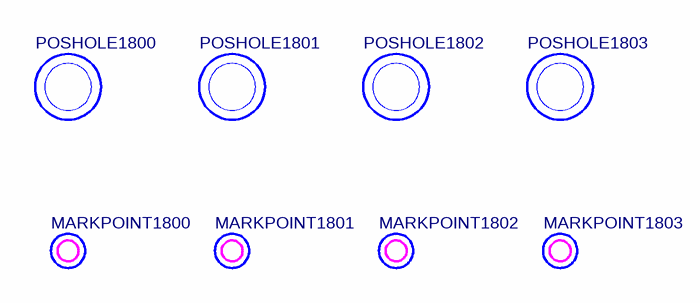
[diagram p17: misc.schdoc]

### Parts
MARKPOINT1800  MARKPOINT  [MARKPOINT-1.0]  (value not drawn)
MARKPOINT1801  MARKPOINT  [MARKPOINT-1.0]  (value not drawn)
MARKPOINT1802  MARKPOINT  [MARKPOINT-1.0]  (value not drawn)
MARKPOINT1803  MARKPOINT  [MARKPOINT-1.0]  (value not drawn)
POSHOLE1800  POSHOLE  [POSHOLE-2.6]  (value not drawn)
POSHOLE1801  POSHOLE  [POSHOLE-2.6]  (value not drawn)
POSHOLE1802  POSHOLE  [POSHOLE-2.6]  (value not drawn)
POSHOLE1803  POSHOLE  [POSHOLE-2.6]  (value not drawn)

### Notes on the sheet
- DRAWN
- CHECKED
- DRAWNBY
- SHEETS
- SHEETS_NO

## Nets that join several sheets
GND: dram (90 pins), hdmi (18 pins), pmic (22 pins), soc-conn (20 pins), soc-pwr (77 pins), usb (51 pins), soc-io (9 pins), debug (18 pins), eth (C1200.1 C1201.1 J1200.8 J1200.13), sd (10 pins), flash (C800.2 C801.2 U800.4 U800.9), wireless (11 pins), fpc (26 pins), header (36 pins), indicator (D1500.1 R1503.1)
VCC1V8_ALDO: dram (18 pins), pmic (6 pins), soc-conn (9 pins)
VCC3V3_DLDO: hdmi (D1101.2), pmic (C316.1 C317.1 R304.1 U300.12), soc-conn (C601.1 C602.1 U400.E18 U400.M18), soc-pwr (C419.2 C420.2 U400.D10), usb (R1001.1), soc-io (10 pins), debug (C1403.2 U1400.1 U1400.5), eth (R1200.2 R1201.2), sd (7 pins), flash (5 pins), wireless (C1301.1 C1304.2 U1300.3), fpc (C1602.1 R1600.2 R1601.2 U1602.5), header (C1702.1 R1700.2 R1705.2 U1700.5), indicator (Q1500.S R1500.2)
VDD5V_IN: hdmi (D1100.2), pmic (6 pins), usb (13 pins), header (C1705.2 R1708.2 R1709.2 U1701.5), indicator (R1501.2)
VDD_CPU: pmic (C307.2 C308.2 C309.2 L301.2), soc-pwr (13 pins)
VDD_DRAM: dram (75 pins), pmic (5 pins)
VDD_GPU: pmic (C303.2 C304.2 C305.2 L300.2), soc-pwr (22 pins)
_H_3: soc-io (U400.B8), header (J1700.3 R1702.1 U1702.1 U1702.10)
_H_5: soc-io (U400.A8), header (J1700.5 R1701.1 U1702.2 U1702.9)
_H_7: soc-io (U400.A2), header (J1700.7 U1702.4 U1702.7)
_H_11: soc-io (U400.C3), header (J1700.11 U1703.2 U1703.9)
_H_12: soc-io (U400.B2), header (J1700.12 U1703.4 U1703.7)
_H_13: soc-io (U400.E3), header (J1700.13 U1703.5 U1703.6)
_H_15: soc-io (U400.B13), header (J1700.15 U1704.1 U1704.10)
_H_16: soc-io (U400.H3), header (J1700.16 U1704.2 U1704.9)
_H_18: soc-io (U400.G3), header (J1700.18 U1704.4 U1704.7)
_H_19: soc-io (U400.B12), header (J1700.19 U1704.5 U1704.6)
_H_21: soc-io (U400.C13), header (J1700.21 U1705.1 U1705.10)
_H_22: soc-io (U400.H2), header (J1700.22 U1705.2 U1705.9)
_H_23: soc-io (U400.C14), header (J1700.23 U1705.4 U1705.7)
_H_24: soc-io (U400.H1), header (J1700.24 U1705.5 U1705.6)
_H_26: soc-io (U400.F2), header (J1700.26 U1706.1 U1706.10)
_H_27: soc-io (U400.F3), header (J1700.27 U1706.2 U1706.9)
_H_28: soc-io (U400.F1), header (J1700.28 U1706.4 U1706.7)
_H_29: soc-io (U400.F4), header (J1700.29 U1706.5 U1706.6)
_H_31: soc-io (U400.C9), header (J1700.31 U1707.1 U1707.10)
_H_32: soc-io (U400.C2), header (J1700.32 U1707.2 U1707.9)
_H_33: soc-io (U400.B10), header (J1700.33 U1707.4 U1707.7)
_H_35: soc-io (U400.A12), header (J1700.35 U1707.5 U1707.6)
_H_36: soc-io (U400.B9), header (J1700.36 U1708.1 U1708.10)
_H_37: soc-io (U400.B14), header (J1700.37 U1708.2 U1708.9)
_H_38: soc-io (U400.C10), header (J1700.38 U1708.4 U1708.7)
_H_40: soc-io (U400.A14), header (J1700.40 U1708.5 U1708.6)
DEBUG_RX: soc-io (U400.D16), debug (R1402.2)
DEBUG_TX: soc-io (U400.D15), debug (R1403.2)
EPHY_RX_N: soc-conn (U400.B21), eth (J1200.6)
EPHY_RX_P: soc-conn (U400.B20), eth (J1200.3)
EPHY_TX_N: soc-conn (U400.A20), eth (J1200.2)
EPHY_TX_P: soc-conn (U400.A19), eth (J1200.1)
FLASH_CLK: soc-io (U400.B1), flash (U800.6)
FLASH_CS: soc-io (R704.1 U400.D1), flash (U800.1)
FLASH_MISO: soc-io (R705.1 U400.D2), flash (U800.2)
FLASH_MOSI: soc-io (U400.C1), flash (U800.5)
FPC_1: soc-io (U400.L4), fpc (J1600.1 U1607.4 U1607.7)
FPC_2: soc-io (U400.L6), fpc (J1600.2 U1607.2 U1607.9)
FPC_3: soc-io (U400.E5), fpc (J1600.3 U1607.1 U1607.10)
FPC_4: soc-io (U400.K5), fpc (J1600.4 U1606.5 U1606.6)
FPC_5: soc-io (U400.K4), fpc (J1600.5 U1606.4 U1606.7)
FPC_6: soc-io (U400.L5), fpc (J1600.6 U1606.2 U1606.9)
FPC_7: soc-io (U400.D5), fpc (J1600.7 U1606.1 U1606.10)
FPC_8: soc-io (U400.E6), fpc (J1600.8 U1605.5 U1605.6)
FPC_9: soc-io (U400.G4), fpc (J1600.9 U1605.4 U1605.7)
FPC_10: soc-io (U400.H5), fpc (J1600.10 U1605.2 U1605.9)
FPC_11: soc-io (U400.H4), fpc (J1600.11 U1605.1 U1605.10)
FPC_12: soc-io (U400.G5), fpc (J1600.12 U1604.5 U1604.6)
FPC_13: soc-io (U400.E4), fpc (J1600.13 U1604.4 U1604.7)
FPC_14: soc-io (U400.G6), fpc (J1600.14 U1604.2 U1604.9)
FPC_15: soc-io (U400.D4), fpc (J1600.15 U1604.1 U1604.10)
FPC_16: soc-io (U400.H6), fpc (J1600.16 U1603.5 U1603.6)
FPC_18: soc-io (U400.C8), fpc (J1600.18 U1603.4 U1603.7)
FPC_19: soc-io (U400.B3), fpc (J1600.19 U1603.2 U1603.9)
FPC_20: soc-io (U400.C4), fpc (J1600.20 U1603.1 U1603.10)
FPC_21: soc-io (U400.B4), fpc (J1600.21 U1601.5 U1601.6)
FPC_22: soc-io (U400.A4), fpc (J1600.22 U1601.4 U1601.7)
FPC_23: soc-io (U400.B7), fpc (J1600.23 U1601.2 U1601.9)
FPC_24: soc-io (U400.C5), fpc (J1600.24 U1601.1 U1601.10)
FPC_25: soc-io (U400.B5), fpc (J1600.25 U1600.5 U1600.6)
FPC_26: soc-io (U400.C6), fpc (J1600.26 U1600.4 U1600.7)
FPC_27: soc-io (U400.C7), fpc (J1600.27 U1600.2 U1600.9)
FPC_28: soc-io (U400.A6), fpc (J1600.28 U1600.1 U1600.10)
HCEC: hdmi (R1105.1), soc-conn (U400.G17)
HDMI_CK_N: hdmi (J1100.14 U1101.5 U1101.6), soc-conn (U400.F21)
HDMI_CK_P: hdmi (J1100.12 U1101.4 U1101.7), soc-conn (U400.F20)
HDMI_D0_N: hdmi (J1100.11 U1101.2 U1101.9), soc-conn (U400.E20)
HDMI_D0_P: hdmi (J1100.9 U1101.1 U1101.10), soc-conn (U400.E19)
HDMI_D1_N: hdmi (J1100.8 U1100.5 U1100.6), soc-conn (U400.D21)
HDMI_D1_P: hdmi (J1100.6 U1100.4 U1100.7), soc-conn (U400.D20)
HDMI_D2_N: hdmi (J1100.5 U1100.2 U1100.9), soc-conn (U400.C20)
HDMI_D2_P: hdmi (J1100.3 U1100.1 U1100.10), soc-conn (U400.C19)
HDMI_HPD: hdmi (R1106.1), soc-conn (U400.G18)
HDMI_SCL: hdmi (R1102.1), soc-conn (U400.F19)
HDMI_SDA: hdmi (R1103.1), soc-conn (U400.G21)
INDICATOR_LED: soc-io (U400.K2), indicator (R1502.1)
PC_EINT12: pmic (R304.2 U300.11), soc-io (U400.G2)
PH2: soc-io (U400.B15), eth (J1200.11), header (J1700.8 R1703.1 U1702.5 U1702.6)
PH3: soc-io (U400.C15), eth (J1200.10), header (J1700.10 R1704.1 U1703.1 U1703.10)
PMIC_FB_CPU: pmic (U300.1), soc-pwr (U400.L8)
PMIC_FB_GPU: pmic (U300.16), soc-pwr (U400.F8)
PMIC_SCL: pmic (R302.2 U300.6), soc-io (U400.C18)
PMIC_SDA: pmic (R301.2 U300.5), soc-io (U400.B18)
RESET: pmic (C318.1 R303.2 U300.13), soc-conn (U400.A16)
SD_CLK: soc-io (U400.K1), sd (R903.1)
SD_CMD: soc-io (U400.K3), sd (R902.1)
SD_D0: soc-io (U400.J3), sd (R904.1)
SD_D1: soc-io (U400.J2), sd (R905.1)
SD_D2: soc-io (U400.L3), sd (R900.1)
SD_D3: soc-io (U400.L2), sd (R901.1)
USB0_D_N: soc-conn (U400.J19), usb (J1000.A7 J1000.B7 U1001.1 U1001.10)
USB0_D_P: soc-conn (U400.J20), usb (J1000.A6 J1000.B6 U1001.2 U1001.9)
USB1_D_N: soc-conn (U400.M19), usb (J1002.A7 J1002.B7 U1005.1 U1005.10)
USB1_D_P: soc-conn (U400.M20), usb (J1002.A6 J1002.B6 U1005.2 U1005.9)
USB2_D_N: soc-conn (U400.K19), wireless (U1300.4)
USB2_D_P: soc-conn (U400.K20), wireless (U1300.5)
USB3_D_N: soc-conn (U400.L19), usb (J1001.A7 J1001.B7 U1004.1 U1004.10)
USB3_D_P: soc-conn (U400.L20), usb (J1001.A6 J1001.B6 U1004.2 U1004.9)
USB_0_CC: usb (D1001.2 D1002.2 R1001.2), soc-io (U400.K6)

## Assembly variants
main: not fitted C603 C1302 C1303 R1000 R1002 R1003 R1009 R1011 R1016 R1017 R1600 R1700 R1708 R?